# Altium project MiCom.PrjPcb (part 6 of 6)
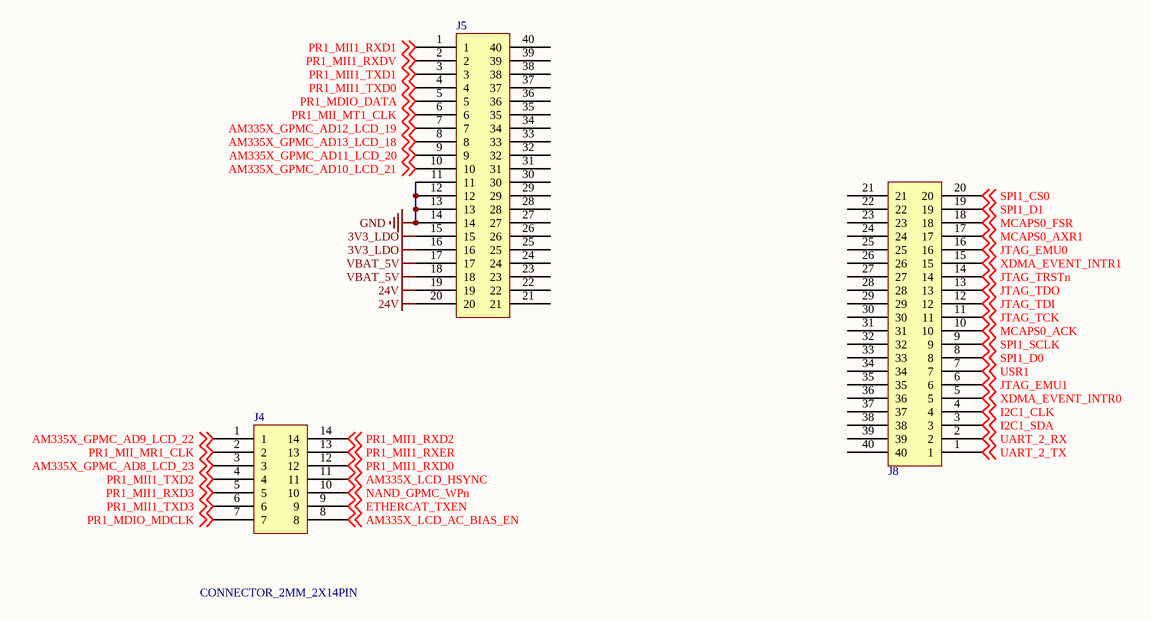
[diagram p26: Connector.SchDoc]

## Nets that join several sheets
1V8_DM: AM3359_A (R1.2 R4.2 U1.5 U1.8), AM3359_B (R13.2), AM3359_C (18 pins), TPS65218 (R52.2)
3V3_DM: AM3359_C (FB1.2), TPS65218 (R53.1)
3V3_LDO: BOOT (16 pins), CAN (C87.1 U9.1), ETHERNET (7 pins), ID_MEMORY (C85.2 J22.1 R87.2 U8.8), MMC (7 pins), POWER_CON (C108.2 U14.2 U14.4), RS232 (C109.2 C110.2 U16.16), RS485 (C115.2 J14.1 J17.3 U17.1), USB_0 (R161.2), Connector (J5.15 J5.16)
24V: POWER_CON (C11.2 J11.1 U10.1), Connector (J5.19 J5.20)
AM335X_VDDSHV1: AM3359_A (R6.2), AM3359_B (R17.2 R18.2), AM3359_C (28 pins), NAND_MEMORY (12 pins)
GND: AM3359_A (7 pins), AM3359_C (64 pins), BOOT (16 pins), CAN (9 pins), DDR_3 (28 pins), ETHERNET (21 pins), ID_MEMORY (6 pins), MMC (FB6.1 J6.6 J6.9), NAND_MEMORY (9 pins), POWER_CON (11 pins), RS232 (10 pins), RS485 (13 pins), TPS65218 (27 pins), USB_0 (8 pins), Connector (J5.11 J5.12 J5.13 J5.14)
GNDA_ADC: AM3359_B (C6.1 C7.1 R14.2), AM3359_C (FB3.1 U2.E8)
PM_SMPS_1: AM3359_C (11 pins), TPS65218 (R47.2)
PM_SMPS_2: AM3359_C (23 pins), TPS65218 (R49.2)
PM_VDDS_DDR: AM3359_C (10 pins), DDR_3 (23 pins), TPS65218 (R50.2)
V_1_0BAT_X: AM3359_C (R20.1), TPS65218 (R55.2)
V_1_8BAT_X: AM3359_C (U2.D7), TPS65218 (6 pins)
VBAT: CAN (C86.1 U9.8), POWER_CON (C106.2 D4.1 R153.2 U14.3), RS485 (C116.2 U17.16), TPS65218 (19 pins), USB_0 (U18.2 U18.3)
VBAT_5V: POWER_CON (C12.1 D7.2 L1.2 U10.4), Connector (J5.17 J5.18)
VREF_AM_DR: AM3359_A (C5.2 U2.J4), DDR_3 (5 pins)
VUSB_VBUS0: AM3359_B (R15.1), USB_0 (7 pins)
AM335X_GPMC_AD0: AM3359_A (U2.U7), NAND_MEMORY (U4.29)
AM335X_GPMC_AD1: AM3359_A (U2.V7), NAND_MEMORY (U4.30)
AM335X_GPMC_AD2: AM3359_A (U2.R8), NAND_MEMORY (U4.31)
AM335X_GPMC_AD3: AM3359_A (U2.T8), NAND_MEMORY (U4.32)
AM335X_GPMC_AD4: AM3359_A (U2.U8), NAND_MEMORY (U4.41)
AM335X_GPMC_AD5: AM3359_A (U2.V8), NAND_MEMORY (U4.42)
AM335X_GPMC_AD6: AM3359_A (U2.R9), NAND_MEMORY (U4.43)
AM335X_GPMC_AD7: AM3359_A (U2.T9), NAND_MEMORY (U4.44)
AM335X_GPMC_ADVn_ALE: AM3359_A (U2.R7), NAND_MEMORY (U4.17)
AM335X_GPMC_BE0n_CLE: AM3359_A (U2.T6), NAND_MEMORY (U4.16)
AM335X_GPMC_CS0n: AM3359_A (U2.V6), NAND_MEMORY (R27.1 U4.9)
AM335X_GPMC_OEn_REn: AM3359_A (U2.T7), NAND_MEMORY (U4.8)
AM335X_GPMC_WAIT: AM3359_A (U2.T17), NAND_MEMORY (R26.1 U4.7)
AM335X_GPMC_WEn: AM3359_A (U2.U6), NAND_MEMORY (U4.18)
AM335X_GPMC_WPn: AM3359_A (U2.U17), NAND_MEMORY (R28.1 U4.19), Connector (J4.10)
AM335X_I2C0_SCL: AM3359_B (R17.1 U2.C16), ID_MEMORY (J23.1 U8.6), TPS65218 (U5.3)
AM335X_I2C0_SDA: AM3359_B (R18.1 U2.C17), ID_MEMORY (J23.2 U8.5), TPS65218 (U5.2)
AM335X_LCD_D0: AM3359_B (U2.R1), BOOT (R107.1 R115.2)
AM335X_LCD_D1: AM3359_B (U2.R2), BOOT (R92.1 R114.2)
AM335X_LCD_D2: AM3359_B (U2.R3), BOOT (R103.1 R120.2)
AM335X_LCD_D3: AM3359_B (U2.R4), BOOT (R101.1 R118.2)
AM335X_LCD_D4: AM3359_B (U2.T1), BOOT (R98.1 R113.2)
AM335X_LCD_D5: AM3359_B (U2.T2), BOOT (R97.1 R112.2)
AM335X_LCD_D6: AM3359_B (U2.T3), BOOT (R102.1 R119.2)
AM335X_LCD_D7: AM3359_B (U2.T4), BOOT (R100.1 R117.2)
AM335X_LCD_D8: AM3359_B (U2.U1), BOOT (R96.1 R111.2)
AM335X_LCD_D9: AM3359_B (U2.U2), BOOT (R95.1 R110.2)
AM335X_LCD_D10: AM3359_B (U2.U3), BOOT (R93.1 R108.2)
AM335X_LCD_D11: AM3359_B (U2.U4), BOOT (R105.1 R122.2)
AM335X_LCD_D12: AM3359_B (U2.V2), BOOT (R94.1 R109.2)
AM335X_LCD_D13: AM3359_B (U2.V3), BOOT (R106.1 R123.2)
AM335X_LCD_D14: AM3359_B (U2.V4), BOOT (R104.1 R121.2)
AM335X_LCD_D15: AM3359_B (U2.T5), BOOT (R99.1 R116.2)
AM335X_MMC0_CLK: AM3359_A (U2.G17), MMC (J6.5)
AM335X_MMC0_CMD: AM3359_A (U2.G18), MMC (J6.3 R142.1)
AM335X_MMC0_D0: AM3359_A (U2.G16), MMC (J6.7 R143.1)
AM335X_MMC0_D1: AM3359_A (U2.G15), MMC (J6.8 R144.1)
AM335X_MMC0_D2: AM3359_A (U2.F18), MMC (J6.1 R140.1)
AM335X_MMC0_D3: AM3359_A (U2.F17), MMC (J6.2 R141.1)
AM335X_NMIn: AM3359_A (U2.B18), TPS65218 (R34.2)
AM335X_UART0_CTSn: AM3359_B (U2.E18), RS232 (U16.9)
AM335X_UART0_RTSn: AM3359_B (U2.E17), RS232 (U16.10)
AM335X_UART0_RXD: AM3359_B (U2.E15), RS232 (U16.12)
AM335X_UART0_TXD: AM3359_B (U2.E16), RS232 (U16.11)
CAN1_RXD: AM3359_B (U2.D17), CAN (C88.1 R126.1)
CAN1_TXD: AM3359_B (U2.D18), CAN (R128.1)
DDR_A_0: AM3359_A (U2.F3), DDR_3 (U3.N3)
DDR_A_1: AM3359_A (U2.H1), DDR_3 (U3.P7)
DDR_A_2: AM3359_A (U2.E4), DDR_3 (U3.P3)
DDR_A_3: AM3359_A (U2.C3), DDR_3 (U3.N2)
DDR_A_4: AM3359_A (U2.C2), DDR_3 (U3.P8)
DDR_A_5: AM3359_A (U2.B1), DDR_3 (U3.P2)
DDR_A_6: AM3359_A (U2.D5), DDR_3 (U3.R8)
DDR_A_7: AM3359_A (U2.E2), DDR_3 (U3.R2)
DDR_A_8: AM3359_A (U2.D4), DDR_3 (U3.T8)
DDR_A_9: AM3359_A (U2.C1), DDR_3 (U3.R3)
DDR_A_10: AM3359_A (U2.F4), DDR_3 (U3.L7)
DDR_A_11: AM3359_A (U2.F2), DDR_3 (U3.R7)
DDR_A_12: AM3359_A (U2.E3), DDR_3 (U3.N7)
DDR_A_13: AM3359_A (U2.H3), DDR_3 (U3.T3)
DDR_A_14: AM3359_A (U2.H4), DDR_3 (U3.T7)
DDR_A_15: AM3359_A (U2.D3), DDR_3 (U3.M7)
DDR_BA_0: AM3359_A (U2.C4), DDR_3 (U3.M2)
DDR_BA_1: AM3359_A (U2.E1), DDR_3 (U3.N8)
DDR_BA_2: AM3359_A (U2.B3), DDR_3 (U3.M3)
DDR_D_0: AM3359_A (U2.M3), DDR_3 (U3.E3)
DDR_D_1: AM3359_A (U2.M4), DDR_3 (U3.F7)
DDR_D_2: AM3359_A (U2.N1), DDR_3 (U3.F2)
DDR_D_3: AM3359_A (U2.N2), DDR_3 (U3.F8)
DDR_D_4: AM3359_A (U2.N3), DDR_3 (U3.H3)
DDR_D_5: AM3359_A (U2.N4), DDR_3 (U3.H8)
DDR_D_6: AM3359_A (U2.P3), DDR_3 (U3.G2)
DDR_D_7: AM3359_A (U2.P4), DDR_3 (U3.H7)
DDR_D_8: AM3359_A (U2.J1), DDR_3 (U3.D7)
DDR_D_9: AM3359_A (U2.K1), DDR_3 (U3.C3)
DDR_D_10: AM3359_A (U2.K2), DDR_3 (U3.C8)
DDR_D_11: AM3359_A (U2.K3), DDR_3 (U3.C2)
DDR_D_12: AM3359_A (U2.K4), DDR_3 (U3.A7)
DDR_D_13: AM3359_A (U2.L3), DDR_3 (U3.A2)
DDR_D_14: AM3359_A (U2.L4), DDR_3 (U3.B8)
DDR_D_15: AM3359_A (U2.M1), DDR_3 (U3.A3)
DDR_D_CASn: AM3359_A (U2.F1), DDR_3 (U3.K3)
DDR_D_CKE: AM3359_A (U2.G3), DDR_3 (R21.2 U3.K9)
DDR_D_CLK: AM3359_A (U2.D2), DDR_3 (DDR_CK1.1 U3.J7)
DDR_D_CLKn: AM3359_A (U2.D1), DDR_3 (U3.K7)
DDR_D_CSn: AM3359_A (U2.H2), DDR_3 (U3.L2)
DDR_D_DQM0: AM3359_A (U2.M2), DDR_3 (U3.E7)
DDR_D_DQM1: AM3359_A (U2.J2), DDR_3 (U3.D3)
DDR_D_DQS0: AM3359_A (U2.P1), DDR_3 (U3.F3)
DDR_D_DQS1: AM3359_A (U2.L1), DDR_3 (U3.C7)
DDR_D_DQSN0: AM3359_A (U2.P2), DDR_3 (U3.G3)
DDR_D_DQSN1: AM3359_A (U2.L2), DDR_3 (U3.B7)
DDR_D_ODT: AM3359_A (U2.G1), DDR_3 (U3.K1)
DDR_D_RASn: AM3359_A (U2.G4), DDR_3 (U3.J3)
DDR_D_WEn: AM3359_A (U2.B2), DDR_3 (U3.L3)
DDR_RESETN: AM3359_A (U2.G2), DDR_3 (R22.1 U3.T2)
ETHERCAT_TXEN: AM3359_A (U2.U9), Connector (J4.9)
I2C1_CLK: AM3359_B (U2.A16), Connector (J8.4)
I2C1_SDA: AM3359_B (U2.B16), Connector (J8.3)
JTAG_EMU0: AM3359_A (U2.C14), Connector (J8.16)
JTAG_EMU1: AM3359_A (U2.B14), Connector (J8.6)
JTAG_TCK: AM3359_A (U2.A12), Connector (J8.11)
JTAG_TDI: AM3359_A (U2.B11), Connector (J8.12)
JTAG_TDO: AM3359_A (U2.A11), Connector (J8.13)
JTAG_TRSTn: AM3359_A (U2.B10), Connector (J8.14)
LCD_18: AM3359_A (U2.R12), Connector (J5.8)
LCD_19: AM3359_A (U2.T12), Connector (J5.7)
LCD_20: AM3359_A (U2.U12), Connector (J5.9)
LCD_21: AM3359_A (U2.T11), Connector (J5.10)
LCD_22: AM3359_A (U2.T10), Connector (J4.1)
LCD_23: AM3359_A (U2.U10), Connector (J4.3)
LCD_BIAS_DEN: AM3359_B (U2.R6), Connector (J4.8)
LCD_HSYNC: AM3359_B (U2.R5), Connector (J4.11)
MCAPS0_ACK: AM3359_B (U2.B12), Connector (J8.10)
MCAPS0_AXR1: AM3359_B (U2.D13), Connector (J8.17)
MCAPS0_FSR: AM3359_B (U2.C13), Connector (J8.18)
MII_1: AM3359_B (U2.K18), ETHERNET (R69.1)
MII_2: AM3359_B (U2.K17), ETHERNET (U7.22)
MII_3: AM3359_B (U2.K16), ETHERNET (U7.23)
MII_4: AM3359_B (U2.K15), ETHERNET (U7.24)
MII_5: AM3359_B (U2.J18), ETHERNET (U7.25)
MII_6: AM3359_B (U2.J16), ETHERNET (U7.21)
MII_9: AM3359_B (U2.L18), ETHERNET (R67.1)
MII_10: AM3359_B (U2.M16), ETHERNET (R65.1)
MII_11: AM3359_B (U2.L15), ETHERNET (R64.1)
MII_12: AM3359_B (U2.L16), ETHERNET (R63.1)
MII_13: AM3359_B (U2.L17), ETHERNET (R62.1)
MII_14: AM3359_B (U2.J15), ETHERNET (R68.1)
MII_15: AM3359_B (U2.J17), ETHERNET (R66.1)
MII_17: AM3359_B (U2.M18), ETHERNET (U7.17)
MII_18: AM3359_B (U2.M17), ETHERNET (R61.1 U7.16)
MII_COL: AM3359_B (U2.H16), ETHERNET (R72.1)
MII_CRS: AM3359_B (U2.H17), ETHERNET (R73.1)
MII_REF_CLK: AM3359_B (U2.H18), ETHERNET (R75.1 R78.1)
MMC_CS0: AM3359_B (U2.C15), MMC (J7.1)
PMIC_DELAYEDRTCPORZ: AM3359_A (R4.1 U1.6), TPS65218 (R37.2)
PMIC_PWR_EN: AM3359_B (R11.1), TPS65218 (R39.2 U5.46)
PMIC_Z: AM3359_A (U1.1), TPS65218 (R36.2)
PR1_MDIO_DATA: AM3359_A (U2.T13), Connector (J5.5)
PR1_MDIO_MDCLK: AM3359_A (U2.V12), Connector (J4.7)
PR1_MII1_RXD0: AM3359_A (U2.V16), Connector (J4.12)
PR1_MII1_RXD1: AM3359_A (U2.T15), Connector (J5.1)
PR1_MII1_RXD2: AM3359_A (U2.U15), Connector (J4.14)
PR1_MII1_RXD3: AM3359_A (U2.V15), Connector (J4.5)
PR1_MII1_RXDV: AM3359_A (U2.T16), Connector (J5.2)
PR1_MII1_RXER: AM3359_A (U2.V17), Connector (J4.13)
PR1_MII1_TXD0: AM3359_A (U2.R14), Connector (J5.4)
PR1_MII1_TXD1: AM3359_A (U2.T14), Connector (J5.3)
PR1_MII1_TXD2: AM3359_A (U2.U14), Connector (J4.4)
PR1_MII1_TXD3: AM3359_A (U2.V14), Connector (J4.6)
PR1_MII_MR1_CLK: AM3359_A (U2.U16), Connector (J4.2)
PR1_MII_MT1_CLK: AM3359_A (U2.R13), Connector (J5.6)
RS485_D: AM3359_B (U2.D15), RS485 (U17.6)
RS485_R: AM3359_B (U2.D16), RS485 (U17.3)
SPI1_CS0: AM3359_B (U2.C12), Connector (J8.20)
SPI1_D0: AM3359_B (U2.B13), Connector (J8.8)
SPI1_D1: AM3359_B (U2.D12), Connector (J8.19)
SPI1_SCLK: AM3359_B (U2.A13), Connector (J8.9)
SYS_RESETn: AM3359_A (R6.1 R8.1 U2.A10), ETHERNET (U7.19)
UART_2_RX: AM3359_B (U2.A17), Connector (J8.2)
UART_2_TX: AM3359_B (U2.B17), Connector (J8.1)
USB0_ID_0: AM3359_B (U2.P16), USB_0 (J19.4 R160.2 U19.3)
USB0_VBUS_EN: AM3359_B (U2.F16), USB_0 (R159.2 U18.4)
USB_0_AM_DM: AM3359_B (U2.N18), USB_0 (L9.2)
USB_0_AM_DP: AM3359_B (U2.N17), USB_0 (L9.1)
USR1: AM3359_B (U2.A14), Connector (J8.7)
WAKEUP0: AM3359_B (R12.1), TPS65218 (R33.2)
XDMA_EVENT_INTR0: AM3359_A (U2.A15), Connector (J8.5)
XDMA_EVENT_INTR1: AM3359_A (U2.D14), Connector (J8.15)